# Altium schematic sheet Sheet3.SchDoc
size A; SheetNumber: 3; SheetTotal: 3
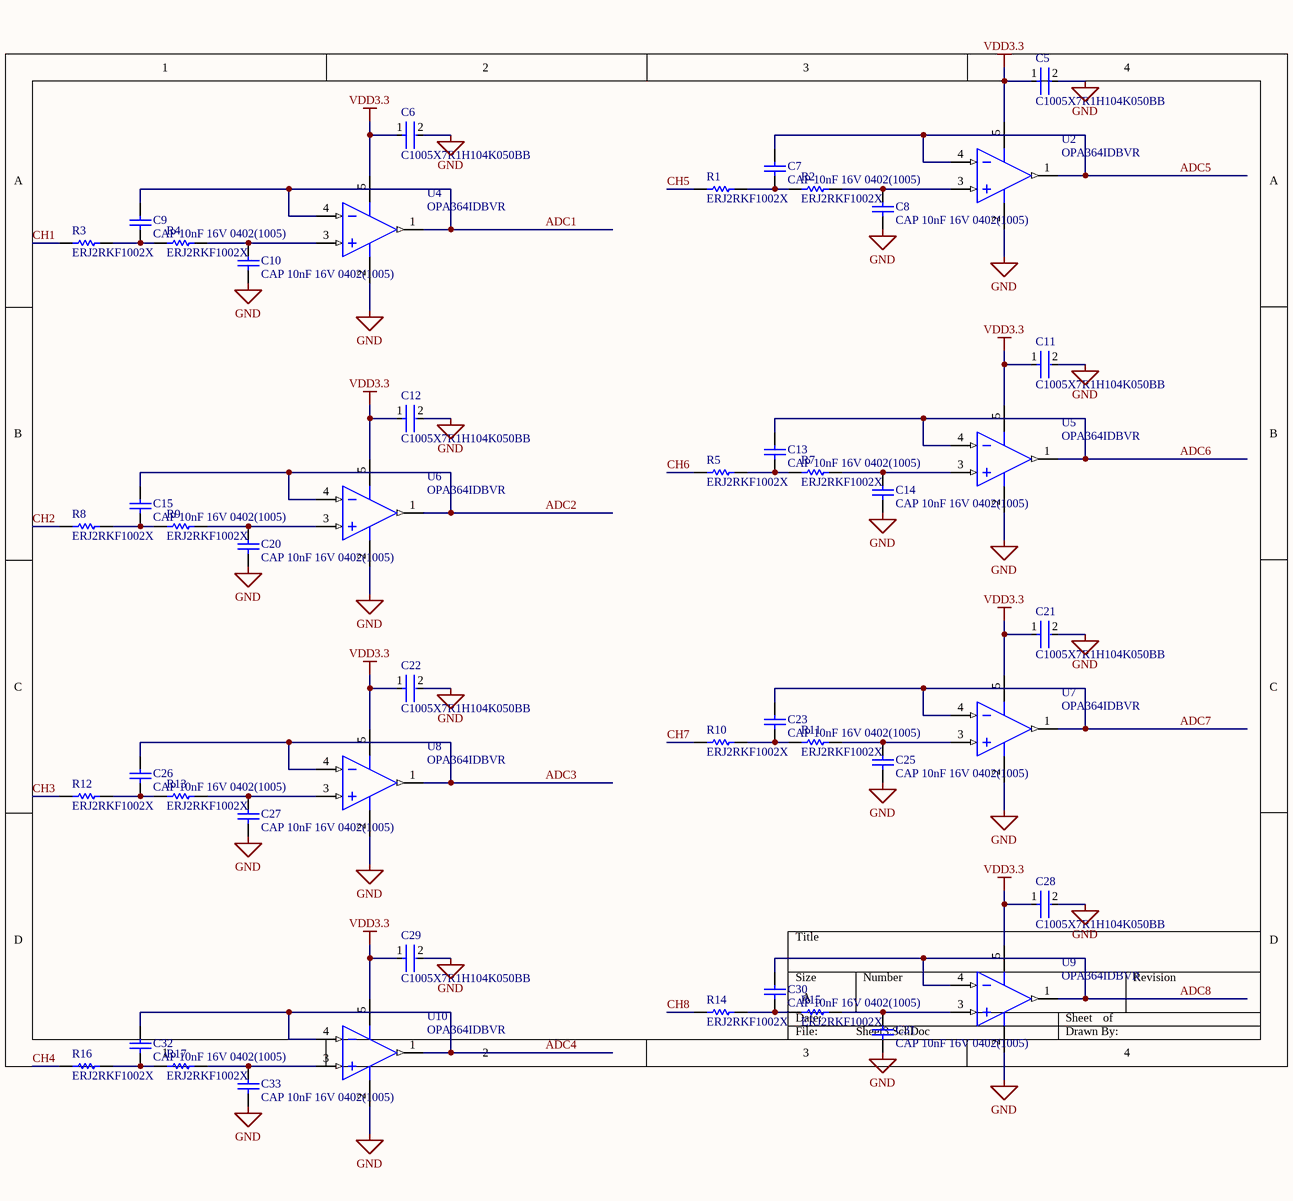
[diagram p0: Sheet3.SchDoc]

## Parts
C5  C1005X7R1H104K050BB  [FP-C1005-050-0_05-IPC_C]
C6  C1005X7R1H104K050BB  [FP-C1005-050-0_05-IPC_C]
C7  CAP 10nF 16V 0402(1005)  [CAPC0402(1005)60_M]
C8  CAP 10nF 16V 0402(1005)  [CAPC0402(1005)60_M]
C9  CAP 10nF 16V 0402(1005)  [CAPC0402(1005)60_M]
C10  CAP 10nF 16V 0402(1005)  [CAPC0402(1005)60_M]
C11  C1005X7R1H104K050BB  [FP-C1005-050-0_05-IPC_C]
C12  C1005X7R1H104K050BB  [FP-C1005-050-0_05-IPC_C]
C13  CAP 10nF 16V 0402(1005)  [CAPC0402(1005)60_M]
C14  CAP 10nF 16V 0402(1005)  [CAPC0402(1005)60_M]
C15  CAP 10nF 16V 0402(1005)  [CAPC0402(1005)60_M]
C20  CAP 10nF 16V 0402(1005)  [CAPC0402(1005)60_M]
C21  C1005X7R1H104K050BB  [FP-C1005-050-0_05-IPC_C]
C22  C1005X7R1H104K050BB  [FP-C1005-050-0_05-IPC_C]
C23  CAP 10nF 16V 0402(1005)  [CAPC0402(1005)60_M]
C25  CAP 10nF 16V 0402(1005)  [CAPC0402(1005)60_M]
C26  CAP 10nF 16V 0402(1005)  [CAPC0402(1005)60_M]
C27  CAP 10nF 16V 0402(1005)  [CAPC0402(1005)60_M]
C28  C1005X7R1H104K050BB  [FP-C1005-050-0_05-IPC_C]
C29  C1005X7R1H104K050BB  [FP-C1005-050-0_05-IPC_C]
C30  CAP 10nF 16V 0402(1005)  [CAPC0402(1005)60_M]
C31  CAP 10nF 16V 0402(1005)  [CAPC0402(1005)60_M]
C32  CAP 10nF 16V 0402(1005)  [CAPC0402(1005)60_M]
C33  CAP 10nF 16V 0402(1005)  [CAPC0402(1005)60_M]
R1  ERJ2RKF1002X  [RESC1005X40X25LL05T05]
R2  ERJ2RKF1002X  [RESC1005X40X25LL05T05]
R3  ERJ2RKF1002X  [RESC1005X40X25LL05T05]
R4  ERJ2RKF1002X  [RESC1005X40X25LL05T05]
R5  ERJ2RKF1002X  [RESC1005X40X25LL05T05]
R7  ERJ2RKF1002X  [RESC1005X40X25LL05T05]
R8  ERJ2RKF1002X  [RESC1005X40X25LL05T05]
R9  ERJ2RKF1002X  [RESC1005X40X25LL05T05]
R10  ERJ2RKF1002X  [RESC1005X40X25LL05T05]
R11  ERJ2RKF1002X  [RESC1005X40X25LL05T05]
R12  ERJ2RKF1002X  [RESC1005X40X25LL05T05]
R13  ERJ2RKF1002X  [RESC1005X40X25LL05T05]
R14  ERJ2RKF1002X  [RESC1005X40X25LL05T05]
R15  ERJ2RKF1002X  [RESC1005X40X25LL05T05]
R16  ERJ2RKF1002X  [RESC1005X40X25LL05T05]
R17  ERJ2RKF1002X  [RESC1005X40X25LL05T05]
U2  OPA364IDBVR  [DBV0005A_M]
U4  OPA364IDBVR  [DBV0005A_M]
U5  OPA364IDBVR  [DBV0005A_M]
U6  OPA364IDBVR  [DBV0005A_M]
U7  OPA364IDBVR  [DBV0005A_M]
U8  OPA364IDBVR  [DBV0005A_M]
U9  OPA364IDBVR  [DBV0005A_M]
U10  OPA364IDBVR  [DBV0005A_M]

## Nets
GND: C5.2 C6.2 C8.1 C10.1 C11.2 C12.2 C14.1 C20.1 C21.2 C22.2 C25.1 C27.1 C28.2 C29.2 C31.1 C33.1 U2.2(V-) U4.2(V-) U5.2(V-) U6.2(V-) U7.2(V-) U8.2(V-) U9.2(V-) U10.2(V-)
VDD3.3: C5.1 C6.1 C11.1 C12.1 C21.1 C22.1 C28.1 C29.1 U2.5(V+) U4.5(V+) U5.5(V+) U6.5(V+) U7.5(V+) U8.5(V+) U9.5(V+) U10.5(V+)
ADC1: C9.2 U4.1(VOUT) U4.4(IN-)
ADC2: C15.2 U6.1(VOUT) U6.4(IN-)
ADC3: C26.2 U8.1(VOUT) U8.4(IN-)
ADC4: C32.2 U10.1(VOUT) U10.4(IN-)
ADC5: C7.2 U2.1(VOUT) U2.4(IN-)
ADC6: C13.2 U5.1(VOUT) U5.4(IN-)
ADC7: C23.2 U7.1(VOUT) U7.4(IN-)
ADC8: C30.2 U9.1(VOUT) U9.4(IN-)
CH1: R3.1
CH2: R8.1
CH3: R12.1
CH4: R16.1
CH5: R1.1
CH6: R5.1
CH7: R10.1
CH8: R14.1
NetC7_1: C7.1 R1.2 R2.1
NetC8_2: C8.2 R2.2 U2.3(IN+)
NetC9_1: C9.1 R3.2 R4.1
NetC10_2: C10.2 R4.2 U4.3(IN+)
NetC13_1: C13.1 R5.2 R7.1
NetC14_2: C14.2 R7.2 U5.3(IN+)
NetC15_1: C15.1 R8.2 R9.1
NetC20_2: C20.2 R9.2 U6.3(IN+)
NetC23_1: C23.1 R10.2 R11.1
NetC25_2: C25.2 R11.2 U7.3(IN+)
NetC26_1: C26.1 R12.2 R13.1
NetC27_2: C27.2 R13.2 U8.3(IN+)
NetC30_1: C30.1 R14.2 R15.1
NetC31_2: C31.2 R15.2 U9.3(IN+)
NetC32_1: C32.1 R16.2 R17.1
NetC33_2: C33.2 R17.2 U10.3(IN+)

## Library data of the parts
C5 C6 C11 C12 C21 C22 C28 C29 = CMP-2000-05393-2: Multilayer Ceramic Capacitors 100nF ±10% 50V X7R SMD 0402; Voltage: 50V; Dielectric Material: Ceramic; Min Operating Temperature: -55°C; Depth: 0.5mm; Radiation Hardening: No; RoHS Compliant: Yes; Voltage Rating (DC): 50V; Lead Free: Lead Free; Resistor Type: Ceramic; Height: 0.5mm; Dielectric: X7R; Thickness: 0.022inch; Case/Package: 0402; Case Code (Metric): 1005; Termination: SMD/SMT; Capacitance: 100nF; Packaging: Tape and Reel; Max Operating Temperature: 125°C; Mount: Surface Mount; Package Quantity: 1; Width: 0.02inch; Weight: 2.3E-05oz; Voltage Rating: 50V; Tolerance: 10%; Construction: Flat; Case Code (Imperial): 0402; Length: 1mm; REACH SVHC: No SVHC; Series: C; LCSC: C307331
C7-C10 C13-C15 C20 C23 C25-C27 C30-C33 = CMP-1034-01878-1: CAP 10nF 16V -20% to +80% 0402 (1005 Metric) Thickness 0.6mm SMD; Case-Metric: 1005; Case-EIA: 0402; Rated Voltage: 16 V; Max Thickness: 0.6 mm; Tolerance: -20% to +80%; Value: 10nF; Technology: SMT; LCSC: C15195
R1-R5 R7-R17 = CMP-2000-07588-1: Chip Resistor, 10 KOhm, +/- 1%, 0.1 W, -55 to 155 degC, 0402 (1005 Metric), RoHS, Tape and Reel; Manufacturer: Panasonic; Power Rating: 100mW; Voltage Rating: 50V; Resistance: 10KOhm; Case\/Package: 0402; Temperature Coefficient: 100ppm\/degreesC; RoHSCompliant: True; Lead Free: LeadFree; Package Quantity: 1; Contact Plating: Tin; Length: 1mm; Radiation Hardening: No; REACH SVHC: NoSVHC; Max Operating Temperature: 155degC; Depth: 0.5mm; Case Code (Imperial): 0402; Military Standard: Not; Package Description: 2-Pin Surface Mount Device, Body 1 x 0.5 mm; Termination: SMD/SMT; Case Code (Metric): 1005; Height: 0.35mm; Packaging: TapeandReel; Voltage Rating (DC): 50V; Package Reference: 402; Number of Pins: 2; Tolerance: 1%; Mounting Technology: SurfaceMount; Width: 0.02inch; Mount: SurfaceMount; Datasheet URL: https://industrial.panasonic.com/cdbs/www-data/pdf/RDA0000/AOA0000C304.pdf; Composition: ThickFilm; Datasheet Version: 02/2017; Manufacturer URL: http://www.panasonic.com/; Max Power Dissipation: 100mW; Number of Terminations: 2; Min Operating Temperature: -55degC; LCSC: C25744
U2 U4-U10 = CMP-0272-00939-3: High CMR, RRIO Operational Amplifier, 1.8 to 5.5 V, -40 to 125 degC, 5-pin SOT23 (DBV5), Green (RoHS & no Sb/Br); Manufacturer: Texas Instruments; CMRR(Min)(dB): 74; Iq per channel(Max)(mA): 1.4; Vio (25C)(Max)(mV): 0.5; Sub Family: Low Input Bias Current Amp (<=10pA), Low Offset Voltage Amplifier (<=500uV), Low Supply Voltage Amplifier (<=2.7V), Precision Amplifier; Total Supply Voltage(Min)(+5V is 5, +/-5V is 10): 1.8; Offset Drift(Typ)(uV/C): 3; Slew Rate(Typ)(V/us): 5; Total Supply Voltage(Max)(+5V is 5, +/-5V is 10): 5.5; IIB(Max)(pA): 10; Number of Channels: 1; ComponentLink2Description: Datasheet; DatasheetVersion: SBOS259C; ComponentLink1Description: Manufacturer URL; ComponentLink1URL: http://www.ti.com/; PackageVersion: 4073253-4/K, 03/2006; Eco-Plan: Green (RoHS & no Sb/Br); Code_JEDEC: MO-178; PartNumber: OPA364IDBVR; PackageReference: DBV0005A; ComponentLink3URL: http://www.ti.com/litv/pdf/mpds018i; ComponentLink3Description: Package Specification; PackageDescription: 5-Pin Plastic Small Outline, Body 1.6 x 2.9 mm, Pitch 0.95 mm; Mounting Technology: Surface Mount; ComponentLink2URL: http://www.ti.com/general/docs/lit/getliterature.tsp?genericPartNumber=OPA364&fileType=pdf; LCSC: C2058317